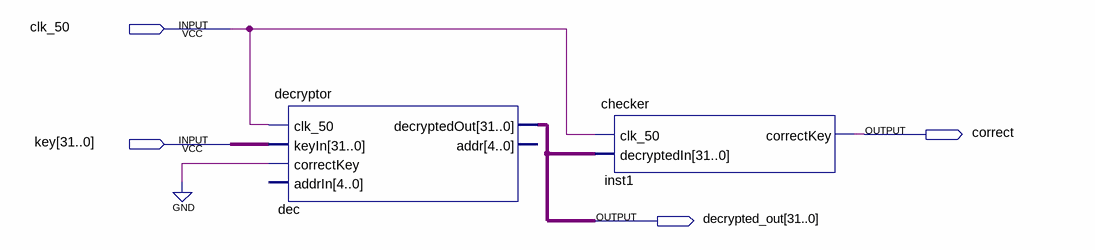
[diagram p0: schematic sheet]
// Quartus schematic debugBlock.bdf as structural Verilog: 2 symbols, 4 pins
module debugBlock (
  input  clk_50,
  input  [31:0] key,
  output correct,
  output [31:0] decrypted_out
);

  decryptor dec (.clk_50(clk_50), .keyIn(key), .correctKey(1'b0), .decryptedOut(decrypted_out));  // open: addrIn, addr
  \checker  inst1 (.clk_50(clk_50), .decryptedIn(decrypted_out), .correctKey(correct));
endmodule
